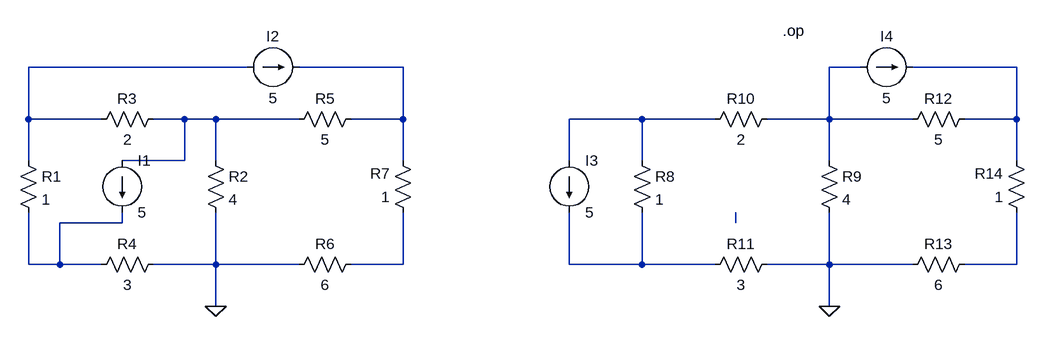
[diagram p0: schematic guia_1A_ej_8.asc]
guia_1A_ej_8.asc, the LTspice schematic file:
Version 4
SHEET 1 1092 680
WIRE -112 224 -448 224
WIRE 128 224 -32 224
WIRE 832 224 784 224
WIRE 1072 224 912 224
WIRE -448 304 -448 224
WIRE -336 304 -448 304
WIRE -208 304 -256 304
WIRE -160 304 -208 304
WIRE -32 304 -160 304
WIRE 128 304 128 224
WIRE 128 304 48 304
WIRE 496 304 384 304
WIRE 608 304 496 304
WIRE 784 304 784 224
WIRE 784 304 688 304
WIRE 912 304 784 304
WIRE 1072 304 1072 224
WIRE 1072 304 992 304
WIRE -448 368 -448 304
WIRE -208 368 -208 304
WIRE -208 368 -304 368
WIRE -160 368 -160 304
WIRE 128 368 128 304
WIRE 384 368 384 304
WIRE 496 368 496 304
WIRE 784 368 784 304
WIRE 1072 368 1072 304
WIRE -304 464 -304 448
WIRE -304 464 -400 464
WIRE 640 464 640 448
WIRE -448 528 -448 448
WIRE -400 528 -400 464
WIRE -400 528 -448 528
WIRE -336 528 -400 528
WIRE -160 528 -160 448
WIRE -160 528 -256 528
WIRE -32 528 -160 528
WIRE 128 528 128 448
WIRE 128 528 48 528
WIRE 384 528 384 448
WIRE 496 528 496 448
WIRE 496 528 384 528
WIRE 608 528 496 528
WIRE 784 528 784 448
WIRE 784 528 688 528
WIRE 912 528 784 528
WIRE 1072 528 1072 448
WIRE 1072 528 992 528
WIRE -160 592 -160 528
WIRE 784 592 784 528
FLAG -160 592 0
FLAG 784 592 0
SYMBOL current -304 368 R0
SYMATTR InstName I1
SYMATTR Value 5
SYMBOL current -112 224 R270
WINDOW 0 32 40 VTop 2
WINDOW 3 -32 40 VBottom 2
SYMATTR InstName I2
SYMATTR Value 5
SYMBOL res -464 352 R0
SYMATTR InstName R1
SYMATTR Value 1
SYMBOL res -176 352 R0
SYMATTR InstName R2
SYMATTR Value 4
SYMBOL res -240 288 R90
WINDOW 0 0 56 VBottom 2
WINDOW 3 32 56 VTop 2
SYMATTR InstName R3
SYMATTR Value 2
SYMBOL res -240 512 R90
WINDOW 0 0 56 VBottom 2
WINDOW 3 32 56 VTop 2
SYMATTR InstName R4
SYMATTR Value 3
SYMBOL res 64 288 R90
WINDOW 0 0 56 VBottom 2
WINDOW 3 32 56 VTop 2
SYMATTR InstName R5
SYMATTR Value 5
SYMBOL res 64 512 R90
WINDOW 0 0 56 VBottom 2
WINDOW 3 32 56 VTop 2
SYMATTR InstName R6
SYMATTR Value 6
SYMBOL res 144 464 R180
WINDOW 0 36 76 Left 2
WINDOW 3 36 40 Left 2
SYMATTR InstName R7
SYMATTR Value 1
SYMBOL current 832 224 R270
WINDOW 0 32 40 VTop 2
WINDOW 3 -32 40 VBottom 2
SYMATTR InstName I4
SYMATTR Value 5
SYMBOL res 480 352 R0
SYMATTR InstName R8
SYMATTR Value 1
SYMBOL res 768 352 R0
SYMATTR InstName R9
SYMATTR Value 4
SYMBOL res 704 288 R90
WINDOW 0 0 56 VBottom 2
WINDOW 3 32 56 VTop 2
SYMATTR InstName R10
SYMATTR Value 2
SYMBOL res 704 512 R90
WINDOW 0 0 56 VBottom 2
WINDOW 3 32 56 VTop 2
SYMATTR InstName R11
SYMATTR Value 3
SYMBOL res 1008 288 R90
WINDOW 0 0 56 VBottom 2
WINDOW 3 32 56 VTop 2
SYMATTR InstName R12
SYMATTR Value 5
SYMBOL res 1008 512 R90
WINDOW 0 0 56 VBottom 2
WINDOW 3 32 56 VTop 2
SYMATTR InstName R13
SYMATTR Value 6
SYMBOL res 1088 464 R180
WINDOW 0 36 76 Left 2
WINDOW 3 36 40 Left 2
SYMATTR InstName R14
SYMATTR Value 1
SYMBOL current 384 368 R0
SYMATTR InstName I3
SYMATTR Value 5
TEXT 712 168 Left 2 !.op

The netlist it stands for:
* guia_1A_ej_8.asc
I1 N005 N007 5
I2 N001 N002 5
R1 N001 N007 1
R2 N005 0 4
R3 N005 N001 2
R4 0 N007 3
R5 N002 N005 5
R6 N009 0 6
R7 N009 N002 1
I4 N003 N004 5
R8 N006 N010 1
R9 N003 0 4
R10 N003 N006 2
R11 0 N010 3
R12 N004 N003 5
R13 N011 0 6
R14 N011 N004 1
I3 N006 N010 5
.op
.backanno
.end